# EAGLE schematic MainStation (EAGLE 5.00)
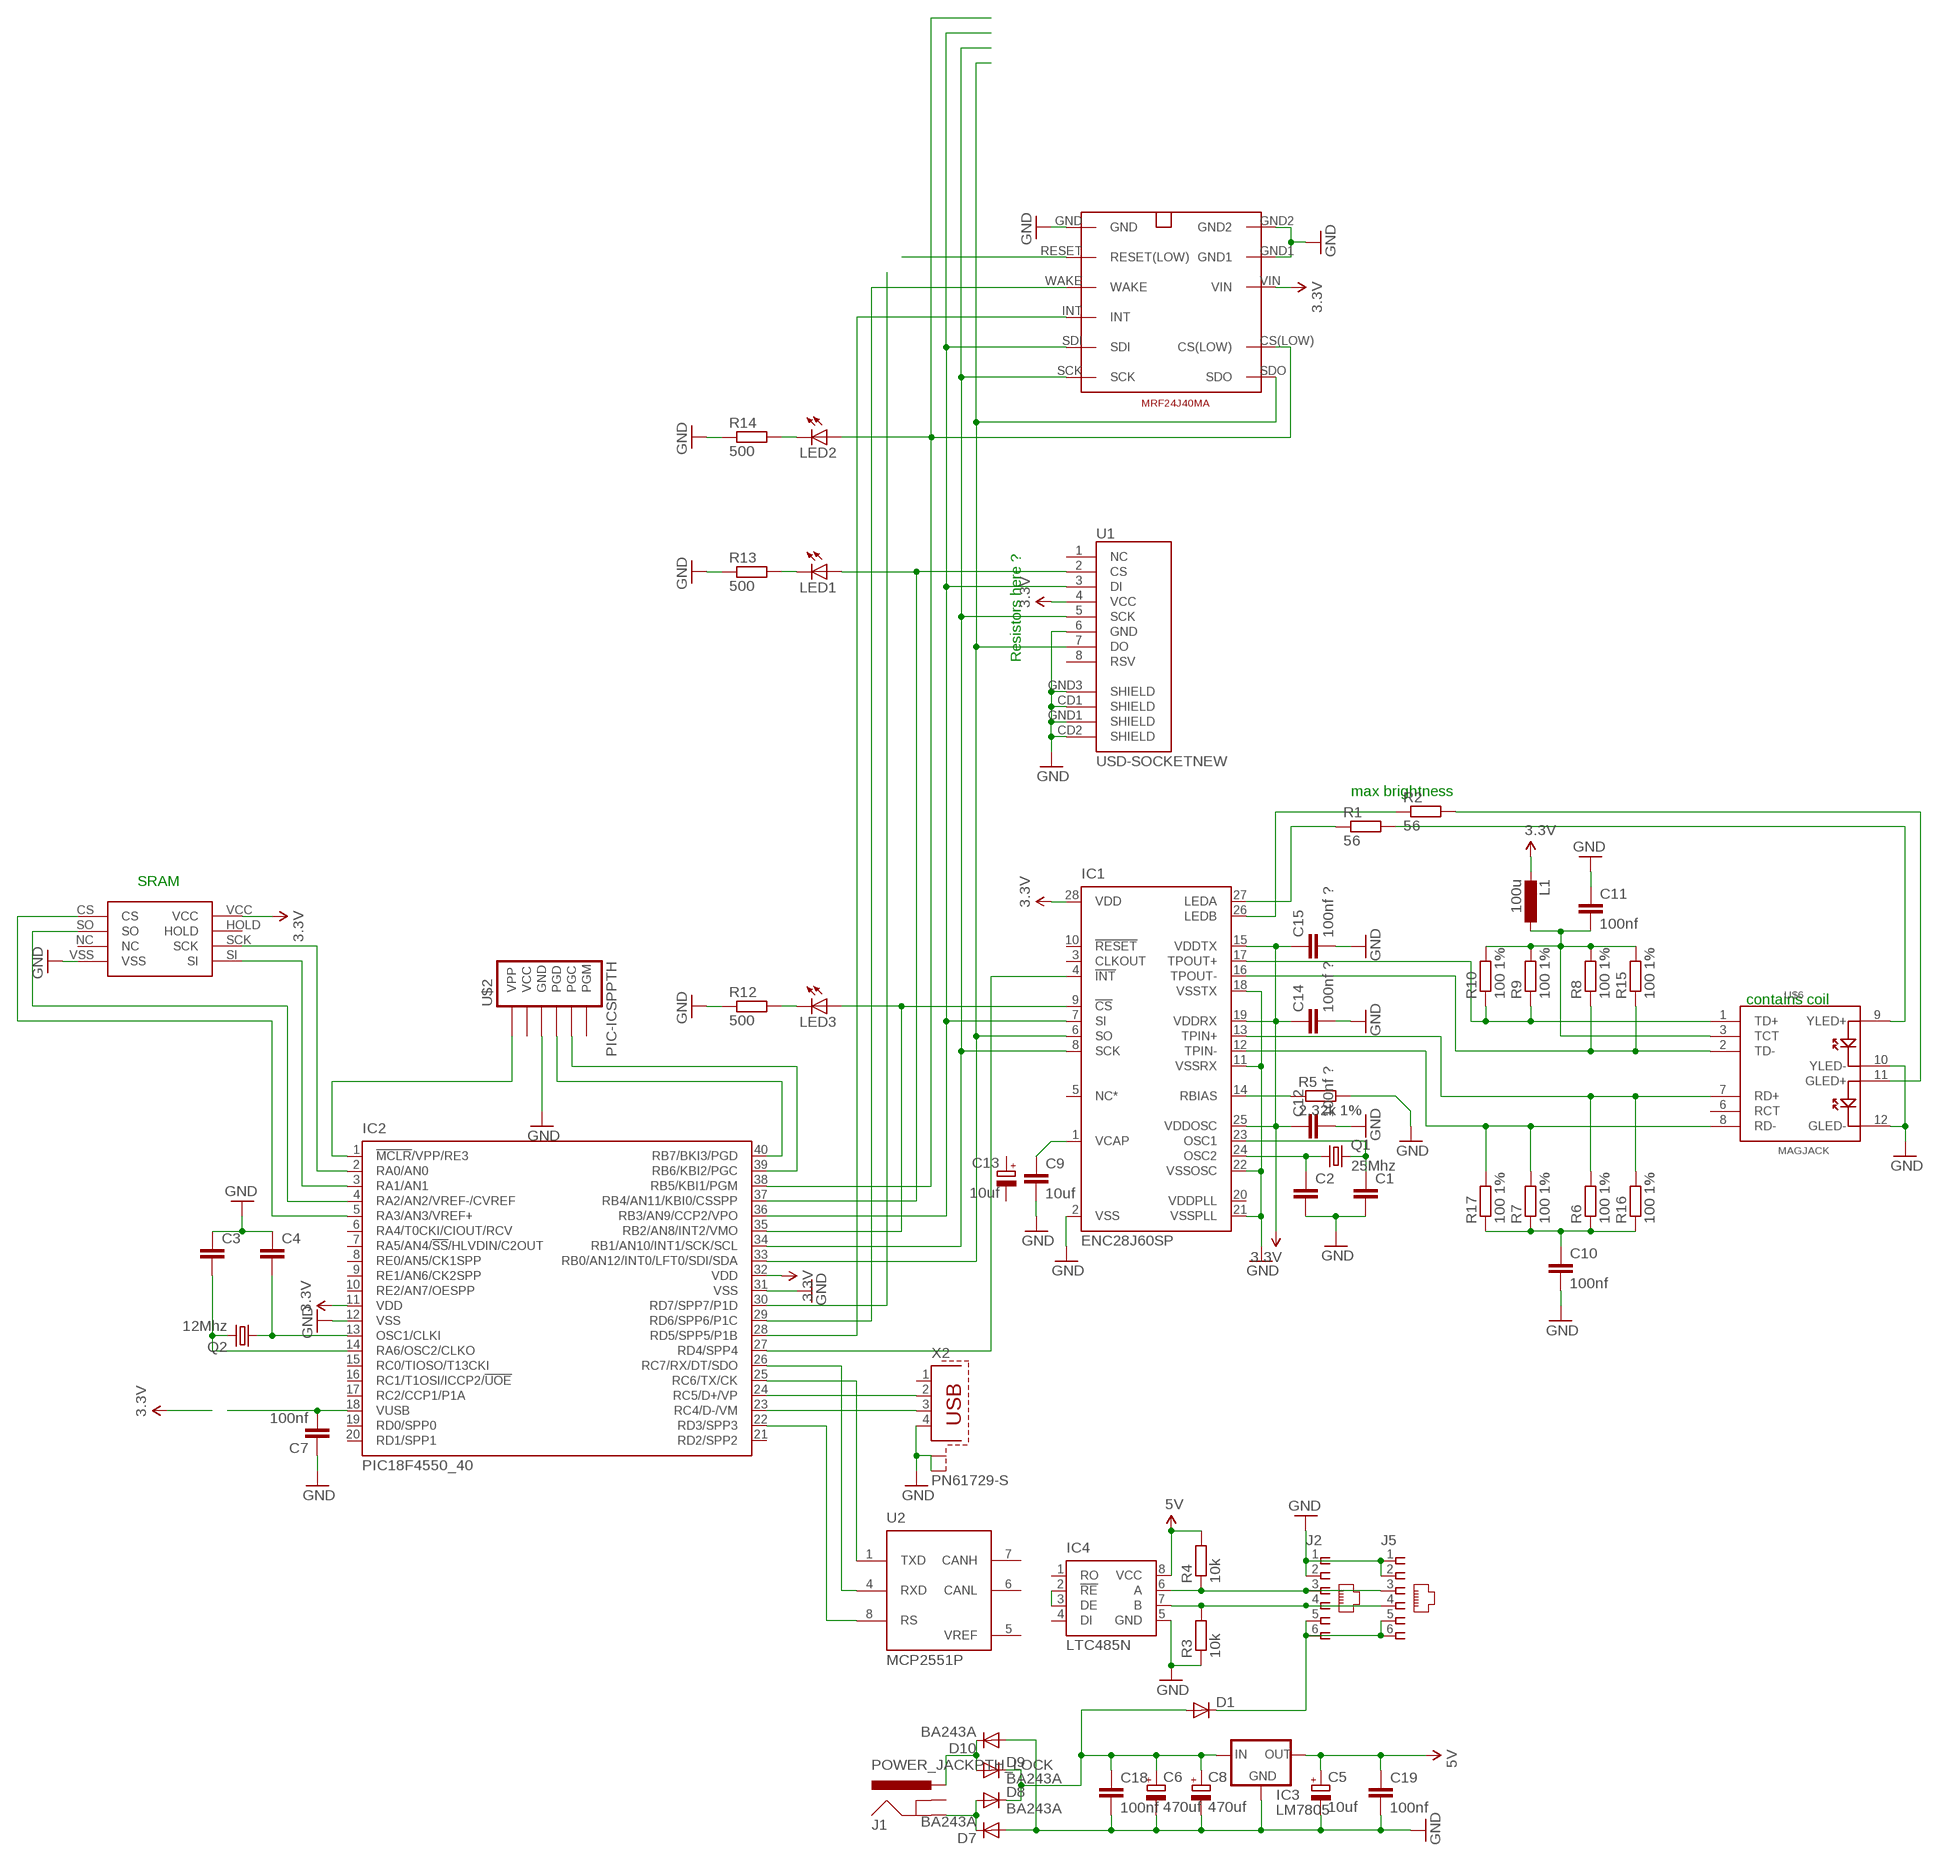
[diagram p0: schematic, sheet 1]

## Parts
C1  C2.5/2  [C2.5-2]
C2  C2.5/2  [C2.5-2]
C3  C2.5/2  [C2.5-2]
C4  C2.5/2  [C2.5-2]
C5  10uf  CPOL-EUE2.5-5  [E2,5-5]
C6  470uf  CPOL-EUE3.5-10  [E3,5-10]
C7  100nf  C2.5/2  [C2.5-2]
C8  470uf  CPOL-EUE3.5-10  [E3,5-10]
C9  10uf  C2.5/2  [C2.5-2]
C10  100nf  C2.5/2  [C2.5-2]
C11  100nf  C2.5/2  [C2.5-2]
C12  100nf ?  C2.5/2  [C2.5-2]
C13  10uf  CPOL-EUE2.5-5  [E2,5-5]
C14  100nf ?  C2.5/2  [C2.5-2]
C15  100nf ?  C2.5/2  [C2.5-2]
C18  100nf  C-EU050-025X075  [C050-025X075]
C19  100nf  C-EU050-025X075  [C050-025X075]
D1  DIODE-DO35-10  [DO35-10]
D7  BA243A  [DO35-10]
D8  BA243A  [DO35-10]
D9  BA243A  [DO35-10]
D10  BA243A  [DO35-10]
IC1  ENC28J60SP  [DIL28-3]
IC2  PIC18F4550_40  [DIL40]
IC3  LM7805  78XXL  [78XXL]
IC4  LTC485N  [DIL08]
J1  POWER_JACKPTH_LOCK  [POWER_JACK_PTH_LOCK]
J2  520470-3  [520470-3]
J5  520470-3  [520470-3]
L1  100u  L-EU2200-12.7  [2200-12.7]
LED1  LED3MM  [LED3MM]
LED2  LED3MM  [LED3MM]
LED3  LED3MM  [LED3MM]
Q1  25Mhz  CRYSTALHC49S  [HC49/S]
Q2  12Mhz  CRYSTALHC49S  [HC49/S]
R1  56  R-EU_0204/5  [0204/5]
R2  56  R-EU_0204/5  [0204/5]
R3  10k  R-EU_0204/7  [0204/7]
R4  10k  R-EU_0204/7  [0204/7]
R5  2.32k 1%  R-EU_0204/5  [0204/5]
R6  100 1%  R-EU_0204/5  [0204/5]
R7  100 1%  R-EU_0204/5  [0204/5]
R8  100 1%  R-EU_0204/5  [0204/5]
R9  100 1%  R-EU_0204/5  [0204/5]
R10  100 1%  R-EU_0204/5  [0204/5]
R12  500  R-EU_0204/5  [0204/5]
R13  500  R-EU_0204/5  [0204/5]
R14  500  R-EU_0204/5  [0204/5]
R15  100 1%  R-EU_0204/5  [0204/5]
R16  100 1%  R-EU_0204/5  [0204/5]
R17  100 1%  R-EU_0204/5  [0204/5]
U1  USD-SOCKETNEW  [MICRO-SD-SOCKET-PP]
U2  MCP2551P  [DIL8]
U$1  23A256  [23A256]
U$2  PIC-ICSPPTH  [MOLEX-1X6]
U$3  MRF24J40MA  [MRF24J40MA]
U$6  MAGJACK  [MAGJACK]
X2  PN61729-S  [PN61729-S]

## Nets
3.3V: C12.1 C14.1 C15.1 IC1.15(VDDTX) IC1.19(VDDRX) IC1.25(VDDOSC) IC1.28(VDD) IC2.11(VDD) IC2.32(VDD) L1.2 U1.4(VCC) U$1.VCC U$3.VIN
5V: C5.+ C19.1 IC3.OUT IC4.8(VCC) R4.2
12V: C6.+ C8.+ C18.1 D1.A D8.C D9.C IC3.IN
GND: C1.2 C2.2 C3.1 C4.1 C5.- C6.- C7.1 C8.- C9.2 C10.2 C11.1 C12.2 C14.2 C15.2 C18.2 C19.2 D7.A D10.A IC1.2(VSS) IC1.11(VSSRX) IC1.18(VSSTX) IC1.21(VSSPLL) IC1.22(VSSOSC) IC2.12(VSS) IC2.31(VSS) IC3.GND IC4.5(GND) J2.1 J2.2 J5.1 J5.2 R3.1 R5.2 R12.1 R13.1 R14.1 U1.6(GND) U1.CD1(SHIELD) U1.CD2(SHIELD) U1.GND1(SHIELD) U1.GND3(SHIELD) U$1.VSS U$2.4(GND) U$3.GND U$3.GND1 U$3.GND2 U$6.10(YLED-) U$6.12(GLED-) X2.4 X2.S1 X2.S2
N$1: R1.2 U$6.9(YLED+)
N$2: R2.2 U$6.11(GLED+)
N$3: IC1.7(SI) IC2.36(RB3/AN9/CCP2/VPO) U1.3(DI) U$3.SDI
N$4: C2.1 IC1.24(OSC2) Q1.1
N$5: IC1.12(TPIN-) R7.2 R17.2 U$6.8(RD-)
N$6: C11.2 L1.1 R8.2 R9.2 R10.2 R15.2 U$6.3(TCT)
N$7: C10.1 R6.1 R7.1 R16.1 R17.1
N$8: IC1.16(TPOUT-) R8.1 R15.1 U$6.2(TD-)
N$9: C1.1 IC1.23(OSC1) Q1.2
N$10: C3.2 IC2.14(RA6/OSC2/CLKO) Q2.2
N$11: IC1.8(SCK) IC2.34(RB1/AN10/INT1/SCK/SCL) U1.5(SCK) U$3.SCK
N$12: IC1.6(SO) IC2.33(RB0/AN12/INT0/LFT0/SDI/SDA) U1.7(DO) U$3.SDO
N$13: IC1.9(!CS) IC2.35(RB2/AN8/INT2/VMO) LED3.A
N$14: C7.2 IC2.18(VUSB)
N$15: IC1.13(TPIN+) R6.2 R16.2 U$6.7(RD+)
N$16: IC2.40(RB7/BKI3/PGD) U$2.3(PGD)
N$17: IC2.39(RB6/KBI2/PGC) U$2.2(PGC)
N$18: IC2.1(!MCLR!/VPP/RE3) U$2.6(VPP)
N$19: IC1.26(LEDB) R2.1
N$20: IC2.24(RC5/D+/VP) X2.2
N$21: C4.2 IC2.13(OSC1/CLKI) Q2.1
N$22: IC1.4(!INT) IC2.27(RD4/SPP4)
N$23: IC2.37(RB4/AN11/KBI0/CSSPP) LED1.A U1.2(CS)
N$24: IC2.38(RB5/KBI1/PGM) LED2.A U$3.CS(LOW)
N$25: IC2.23(RC4/D-/VM) X2.3
N$26: U$3.RESET(RESET(LOW))
N$27: D7.C D8.A J1.GND
N$28: D9.A D10.C J1.PWR
N$29: IC4.6(A) J2.3 J5.3 R4.1
N$30: IC4.7(B) J2.4 J5.4 R3.2
N$31: IC2.26(RC7/RX/DT/SDO) U2.4(RXD)
N$32: IC2.22(RD3/SPP3) U2.8(RS)
N$33: D1.C J2.5 J2.6 J5.5 J5.6
N$34: IC2.2(RA0/AN0) U$1.SCK
N$35: IC2.30(RD7/SPP7/P1D)
N$36: IC2.29(RD6/SPP6/P1C) U$3.WAKE
N$37: IC2.28(RD5/SPP5/P1B) U$3.INT
N$38: IC1.27(LEDA) R1.1
N$40: IC1.17(TPOUT+) R9.1 R10.1 U$6.1(TD+)
N$41: IC2.25(RC6/TX/CK) U2.1(TXD)
N$42: C9.1 IC1.1(VCAP)
N$43: IC1.14(RBIAS) R5.1
N$45: IC2.3(RA1/AN1) U$1.SI
N$46: IC2.4(RA2/AN2/VREF-/CVREF) U$1.SO
N$47: IC2.5(RA3/AN3/VREF+) U$1.CS
N$48: LED3.K(C) R12.2
N$49: LED2.K(C) R14.2
N$50: LED1.K(C) R13.2
N$51: IC4.2(!RE) IC4.3(DE)
Unconnected: C13.+ C13.- IC1.3(CLKOUT) IC1.5(NC*) IC1.10(!RESET) IC1.20(VDDPLL) IC2.6(RA4/T0CKI/CIOUT/RCV) IC2.7(RA5/AN4/!SS!/HLVDIN/C2OUT) IC2.8(RE0/AN5/CK1SPP) IC2.9(RE1/AN6/CK2SPP) IC2.10(RE2/AN7/OESPP) IC2.15(RC0/TIOSO/T13CKI) IC2.16(RC1/T1OSI/ICCP2/!UOE) IC2.17(RC2/CCP1/P1A) IC2.19(RD0/SPP0) IC2.20(RD1/SPP1) IC2.21(RD2/SPP2) IC4.1(RO) IC4.4(DI) J1.GNDBREAK U1.1(NC) U1.8(RSV) U2.6(CANL) U2.7(CANH) U$1.HOLD U$1.NC U$2.1(PGM) U$2.5(VCC) U$6.6(RCT) X2.1

## Notes on the sheet
- Resistors here ?
- max brightness
- SRAM
- contains coil

## Power pins joined to a net without a drawn wire
VDD: U2.3(VDD)
VREF: U2.5(VREF)
VSS: U2.2(VSS)

## Library data of the parts
C1-C4 C7 C9-C12 C14 C15 = capacitor-wima:C: CAPACITOR naming: grid - package width
C5 C6 C8 C13 = rcl:CPOL-EU: POLARIZED CAPACITOR, European symbol
C18 C19 = rcl:C-EU: CAPACITOR, European symbol
D1 = diode:DIODE-: DIODE
D7-D10 = diode:BA243A: DIODE
IC1 = microchip-6:ENC28J60: Stand-Alone Ethernet Controller with SPI Interface Source: http://ww1.microchip.com/downloads/en/DeviceDoc/39662c.pdf
IC2 = microchip:PIC18F4*_40: USB Microcontrollers with nanoWatt Technology High-Performance, Enhanced Flash, 28/40/44-Pin, Source: http://ww1.microchip.com/downloads/en/devicedoc/39632c.pdf
IC3 = v-reg:78XXL: VOLTAGE REGULATOR
IC4 = linear-technology:LTC485: Low Power RS485 Interface Transceiver Source: http://www.linear.com/pc/downloadDocument.do?navId=H0,C1,C1007,C1017,P2064,D1718
J1 = SparkFun:POWER_JACK: Power Jack This is the standard 5.5mm barrel jack for power. The PTH is the most common, proven, reliable, footprint. All others are experimental. The Slot footprint only works if the mill layer is transmitted to the PCB fab house so be warned. Spark Fun Electronics SKU : PRT-00119. Mating wall wart : TOL-00298 (and others)
J2 J5 = con-amp:520470-3: AMP connector
L1 = resistor:L-EU: INDUCTOR, European symbol
LED1-LED3 = led:LED: LED OSRAM: - CHIPLED LG R971, LG N971, LY N971, LG Q971, LY Q971, LO R971, LY R971 LH N974, LH R974 LS Q976, LO Q976, LY Q976 LO Q996 - Hyper CHIPLED LW Q18S LB Q993, LB Q99A, LB R99A - SideLED LS A670, LO A670, LY A670, LG A670, LP A670 LB A673, LV A673, LT A673, LW A673 LH A674 LY A675 LS A676, LA A676, LO A676, LY A676, LW A676 LS A679, LY A679, LG A679 - Hyper Micro SIDELED® LS Y876, LA Y876, LO Y876, LY Y876 LT Y87S - SmartLED LW L88C, LW L88S LB L89C, LB L89S, LG L890 LS L89K, LO L89K, LY L89K LS L896, LA L896, LO L896, LY L896 - TOPLED LS T670, LO T670, LY T670, LG T670, LP T670 LSG T670, LSP T670, LSY T670, LOP T670, LYG T670 LG T671, LOG T671, LSG T671 LB T673, LV T673, LT T673, LW T673 LH T674 LS T676, LA T676, LO T676, LY T676, LB T676, LH T676, LSB T676, LW T676 LB T67C, LV T67C, LT T67C, LS T67K, LO T67K, LY T67K, LW E67C LS E67B, LA E67B, LO E67B, LY E67B, LB E67C, LV E67C, LT E67C LW T67C LS T679, LY T679, LG T679 LS T770, LO T770, LY T770, LG T770, LP T770 LB T773, LV T773, LT T773, LW T773 LH T774 LS E675, LA E675, LY E675, LS T675 LS T776, LA T776, LO T776, LY T776, LB T776 LHGB T686 LT T68C, LB T68C - Hyper Mini TOPLED® LB M676 - Mini TOPLED Santana® LG M470 LS M47K, LO M47K, LY M47K Source: http://www.osram.convergy.de LUXEON: - LUMILED® LXK2-PW12-R00, LXK2-PW12-S00, LXK2-PW14-U00, LXK2-PW14-V00 LXK2-PM12-R00, LXK2-PM12-S00, LXK2-PM14-U00 LXK2-PE12-Q00, LXK2-PE12-R00, LXK2-PE12-S00, LXK2-PE14-T00, LXK2-PE14-U00 LXK2-PB12-K00, LXK2-PB12-L00, LXK2-PB12-M00, LXK2-PB14-N00, LXK2-PB14-P00, LXK2-PB14-Q00 LXK2-PR12-L00, LXK2-PR12-M00, LXK2-PR14-Q00, LXK2-PR14-R00 LXK2-PD12-Q00, LXK2-PD12-R00, LXK2-PD12-S00 LXK2-PH12-R00, LXK2-PH12-S00 LXK2-PL12-P00, LXK2-PL12-Q00, LXK2-PL12-R00 Source: www.luxeon.com KINGBRIGHT: KA-3528ASYC Source: www.kingbright.com
Q1 Q2 = crystal:CRYSTAL: CRYSTAL
R1-R10 R12-R17 = rcl:R-EU_: RESISTOR, European symbol
U1 = SparkFun:USD-SOCKET: microSD Socket Push-push type uSD socket. Schematic element and footprint production proven. Spark Fun Electronics SKU : PRT-00127. tDoc lines correctly indicate media card edge positions when inserting (unlocked, locked, depressed).
U2 = microchip_can:MCP2551: High Speed CAN tranceiver
U$1 = 23A256:23A256
U$2 = SparkFun:PIC-ICSP: ISCP Programming connector for UAV, UBW Kit, etc.
U$3 = MRF24J40MA:MRF24J40MA
U$6 = SparkFun:MAGJACK
X2 = con-berg:PN61729-S: BERG USB connector